# EAGLE schematic GBCartRead_Schematic_v1.6 (EAGLE 6.4)
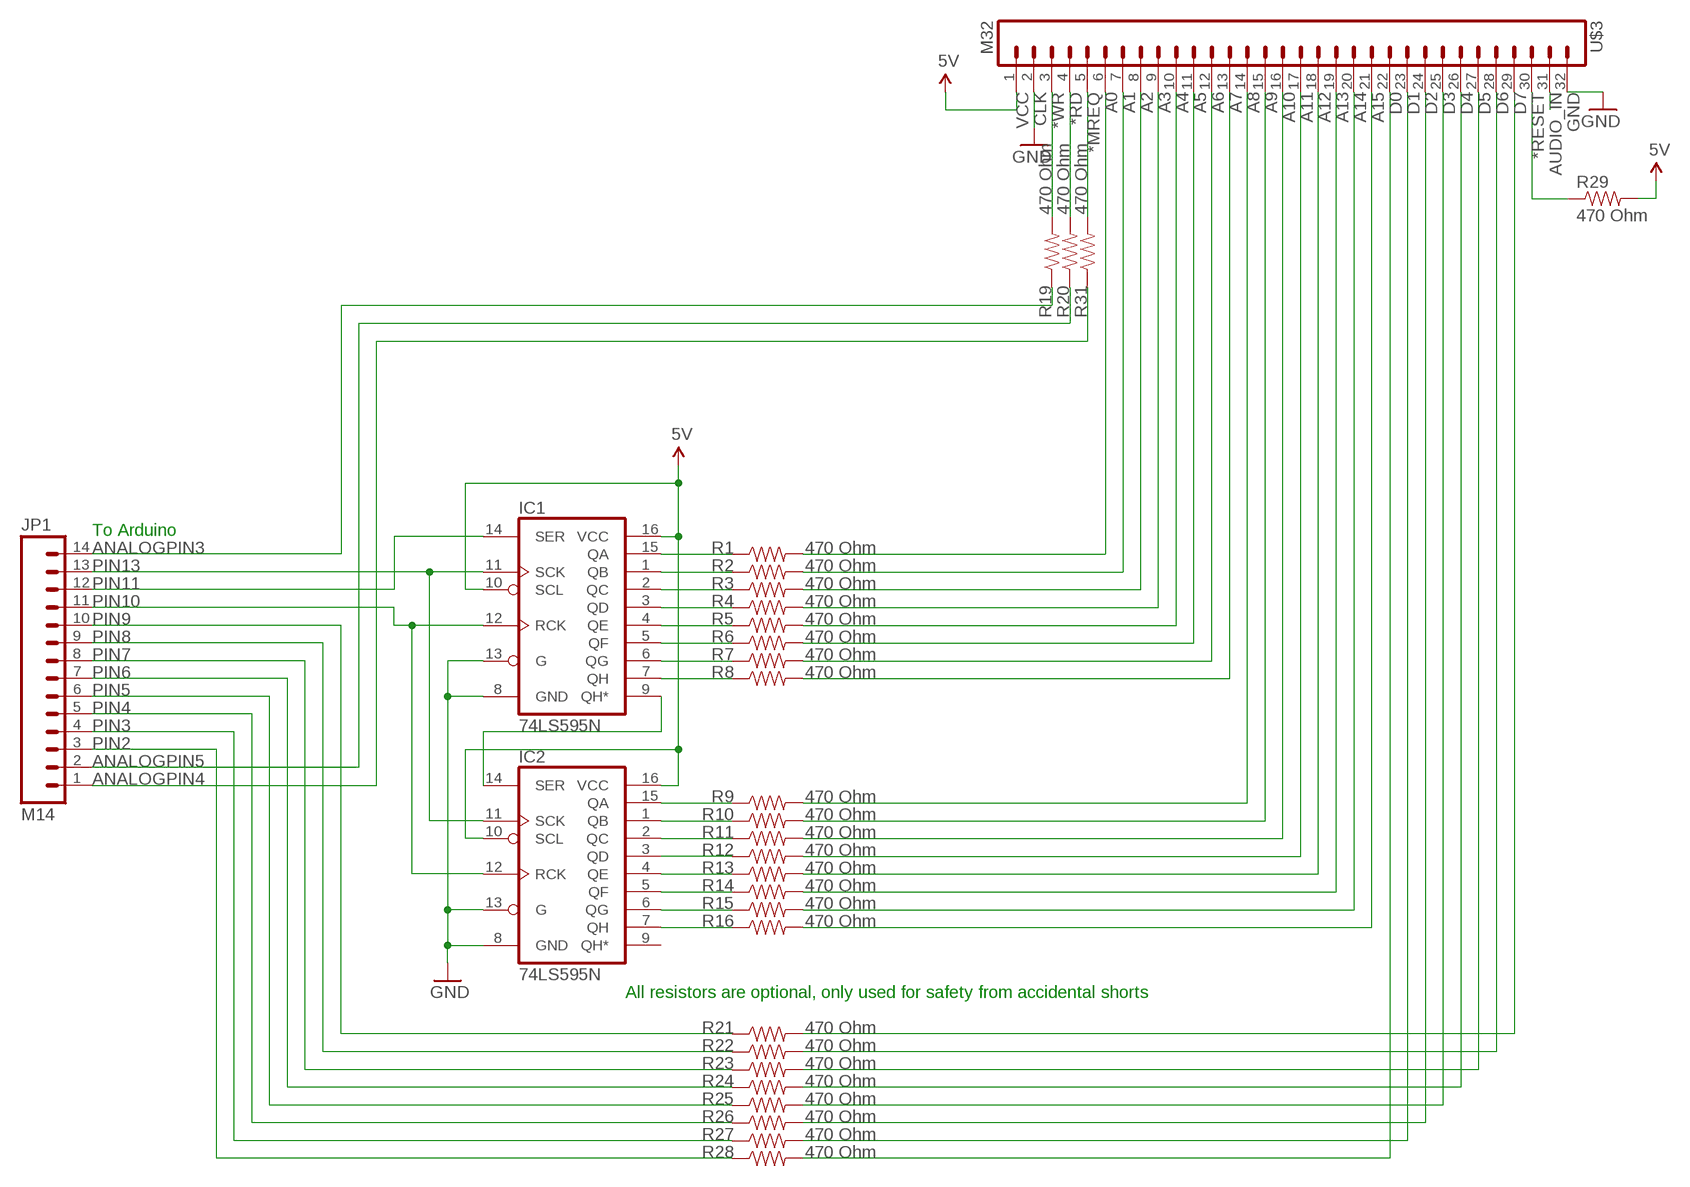
[diagram p0: schematic, sheet 1]

## Parts
IC1  74LS595N  [DIL16]
IC2  74LS595N  [DIL16]
JP1  M14  [1X14]
R1  470 Ohm  RESISTORPTH1  [AXIAL-0.3]
R2  470 Ohm  RESISTORPTH1  [AXIAL-0.3]
R3  470 Ohm  RESISTORPTH1  [AXIAL-0.3]
R4  470 Ohm  RESISTORPTH1  [AXIAL-0.3]
R5  470 Ohm  RESISTORPTH1  [AXIAL-0.3]
R6  470 Ohm  RESISTORPTH1  [AXIAL-0.3]
R7  470 Ohm  RESISTORPTH1  [AXIAL-0.3]
R8  470 Ohm  RESISTORPTH1  [AXIAL-0.3]
R9  470 Ohm  RESISTORPTH1  [AXIAL-0.3]
R10  470 Ohm  RESISTORPTH1  [AXIAL-0.3]
R11  470 Ohm  RESISTORPTH1  [AXIAL-0.3]
R12  470 Ohm  RESISTORPTH1  [AXIAL-0.3]
R13  470 Ohm  RESISTORPTH1  [AXIAL-0.3]
R14  470 Ohm  RESISTORPTH1  [AXIAL-0.3]
R15  470 Ohm  RESISTORPTH1  [AXIAL-0.3]
R16  470 Ohm  RESISTORPTH1  [AXIAL-0.3]
R19  470 Ohm  RESISTORPTH1  [AXIAL-0.3]
R20  470 Ohm  RESISTORPTH1  [AXIAL-0.3]
R21  470 Ohm  RESISTORPTH1  [AXIAL-0.3]
R22  470 Ohm  RESISTORPTH1  [AXIAL-0.3]
R23  470 Ohm  RESISTORPTH1  [AXIAL-0.3]
R24  470 Ohm  RESISTORPTH1  [AXIAL-0.3]
R25  470 Ohm  RESISTORPTH1  [AXIAL-0.3]
R26  470 Ohm  RESISTORPTH1  [AXIAL-0.3]
R27  470 Ohm  RESISTORPTH1  [AXIAL-0.3]
R28  470 Ohm  RESISTORPTH1  [AXIAL-0.3]
R29  470 Ohm  RESISTORPTH1  [AXIAL-0.3]
R31  470 Ohm  RESISTORPTH1  [AXIAL-0.3]
U$3  M32  [1X32]

## Nets
5V: IC1.10(SCL) IC1.16(VCC) IC2.10(SCL) IC2.16(VCC)
*MREQ: R31.P$2 U$3.5
*RD: R20.P$2 U$3.4
*RESET: R29.P$1 U$3.30
*WR: R19.P$2 U$3.3
A0: R1.P$2 U$3.6
A1: R2.P$2 U$3.7
A2: R3.P$2 U$3.8
A3: R4.P$2 U$3.9
A4: R5.P$2 U$3.10
A5: R6.P$2 U$3.11
A6: R7.P$2 U$3.12
A7: R8.P$2 U$3.13
A8: R9.P$2 U$3.14
A9: R10.P$2 U$3.15
A10: R11.P$2 U$3.16
A11: R12.P$2 U$3.17
A12: R13.P$2 U$3.18
A13: R14.P$2 U$3.19
A14: R15.P$2 U$3.20
A15: R16.P$2 U$3.21
ANALOGPIN3: JP1.14 R19.P$1
ANALOGPIN4: JP1.1 R31.P$1
ANALOGPIN5: JP1.2 R20.P$1
AUDIO_IN: U$3.31
CLK: U$3.2 ; supply symbol labelled GND
D0: R28.P$2 U$3.22
D1: R27.P$2 U$3.23
D2: R26.P$2 U$3.24
D3: R25.P$2 U$3.25
D4: R24.P$2 U$3.26
D5: R23.P$2 U$3.27
D6: R22.P$2 U$3.28
D7: R21.P$2 U$3.29
GND: IC1.8(GND) IC1.13(G) IC2.8(GND) IC2.13(G) U$3.32
N$1: IC2.15(QA) R9.P$1
N$2: IC1.1(QB) R2.P$1
N$3: IC2.1(QB) R10.P$1
N$4: IC2.2(QC) R11.P$1
N$5: IC2.3(QD) R12.P$1
N$6: IC2.4(QE) R13.P$1
N$7: IC2.5(QF) R14.P$1
N$8: IC2.6(QG) R15.P$1
N$9: IC2.7(QH) R16.P$1
N$10: IC1.9(QH*) IC2.14(SER)
N$26: IC1.15(QA) R1.P$1
N$27: IC1.7(QH) R8.P$1
N$28: IC1.6(QG) R7.P$1
N$29: IC1.5(QF) R6.P$1
N$30: IC1.4(QE) R5.P$1
N$31: IC1.3(QD) R4.P$1
N$32: IC1.2(QC) R3.P$1
PIN2: JP1.3 R28.P$1
PIN3: JP1.4 R27.P$1
PIN4: JP1.5 R26.P$1
PIN5: JP1.6 R25.P$1
PIN6: JP1.7 R24.P$1
PIN7: JP1.8 R23.P$1
PIN8: JP1.9 R22.P$1
PIN9: JP1.10 R21.P$1
PIN10: IC1.12(RCK) IC2.12(RCK) JP1.11
PIN11: IC1.14(SER) JP1.12
PIN13: IC1.11(SCK) IC2.11(SCK) JP1.13
VCC: R29.P$2 U$3.1 ; supply symbol labelled 5V
Unconnected: IC2.9(QH*)

## Notes on the sheet
- To Arduino
- All resistors are optional, only used for safety from accidental shorts

## Library data of the parts
IC1 IC2 = SparkFun:74*595: 8-bit SHIFT REGISTER, output latch
JP1 = SparkFun:M14: Header 14 Standard 14-pin 0.1" header. Use with straight break away headers (SKU : PRT-00116), right angle break away headers (PRT-00553), swiss pins (PRT-00743), machine pins (PRT-00117), and female headers (PRT-00115).
R1-R16 R19-R29 R31 = SparkFun:RESISTOR: Resistor Basic schematic elements and footprints for 0603, 1206, and PTH 1/10th watt (small) resistors.
U$3 = SparkFun:M32